# EAGLE design PLL_Board (EAGLE 5.10)
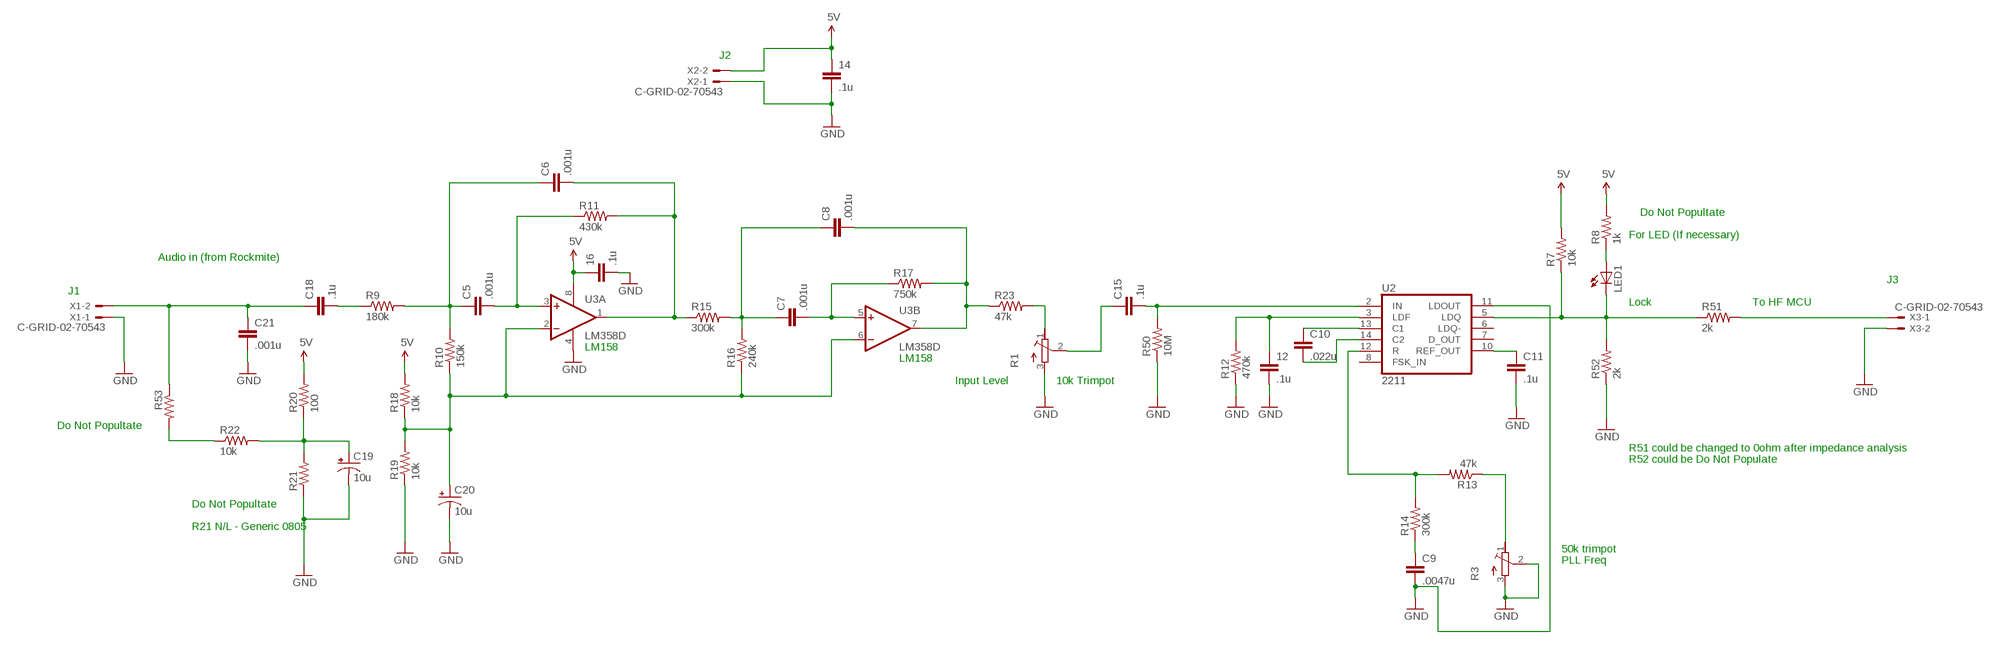
[diagram p0: schematic, sheet 1]

## Parts
12  .1u  CAP1210  [1210]
14  .1u  CAP1210  [1210]
16  .1u  CAP1210  [1210]
C5  .001u  CAP0805  [0805]
C6  .001u  CAP0805  [0805]
C7  .001u  CAP0805  [0805]
C8  .001u  CAP0805  [0805]
C9  .0047u  CAP0603-CAP  [0603-CAP]
C10  .022u  CAP0603-CAP  [0603-CAP]
C11  .1u  CAP1210  [1210]
C15  .1u  CAP1210  [1210]
C18  .1u  CAP1210  [1210]
C19  10u  CAP_POL7343  [EIA7343]
C20  10u  CAP_POL7343  [EIA7343]
C21  .001u  CAP0805  [0805]
LED1  LEDCHIPLED_0805  [CHIPLED_0805]
R1  R-TRIMMT93YA  [RTRIMT93YA]
R3  R-TRIMMT93YA  [RTRIMT93YA]
R7  10k  RESISTOR2010  [R2010]
R8  1k  RESISTOR1206  [1206]
R9  180k  RESISTOR  [0805]
R10  150k  RESISTOR1206  [1206]
R11  430k  RESISTOR1206  [1206]
R12  470k  RESISTOR1206  [1206]
R13  47k  RESISTOR2010  [R2010]
R14  300k  RESISTOR1206  [1206]
R15  300k  RESISTOR1206  [1206]
R16  240k  RESISTOR1206  [1206]
R17  750k  RESISTOR1206  [1206]
R18  10k  RESISTOR2010  [R2010]
R19  10k  RESISTOR2010  [R2010]
R20  100  RESISTOR1206  [1206]
R21  R-US_R0805  [R0805]
R22  10k  RESISTOR2010  [R2010]
R23  47k  RESISTOR2010  [R2010]
R50  10M  RESISTOR2010  [R2010]
R51  2k  R-US_R1210  [R1210]
R52  2k  R-US_R1210  [R1210]
R53  R-US_R0805  [R0805]
U2  2211  XR-2211  [DIL14]
U3  LM358D  [SO08]
X1  C-GRID-02-70543  [70543-02]
X2  C-GRID-02-70543  [70543-02]
X3  C-GRID-02-70543  [70543-02]

## Nets
5V: 14.1 16.1 R7.2 R8.2 R18.2 R20.2 U3.8(P:V+) X2.2
GND: 12.2 14.2 16.2 C9.2 C11.2 C19.C(-) C20.C(-) C21.2 R1.3(E) R3.2(S) R3.3(E) R12.1 R19.1 R21.1 R50.1 R52.1 U2.11(LDOUT) U3.4(P:V-) X1.1 X2.1 X3.2
N$2: C19.A(+) R20.1 R21.2 R22.2
N$3: C18.2 R9.1
N$4: C5.1 C6.1 R9.2 R10.2
N$5: C20.A(+) R10.1 R16.1 R18.1 R19.2 U3.2(A:-IN) U3.6(B:-IN)
N$6: C5.2 R11.1 U3.3(A:+IN)
N$7: C6.2 R11.2 R15.1 U3.1(A:OUT)
N$8: C18.1 C21.1 R53.1 X1.2
N$9: C7.1 C8.1 R15.2 R16.2
N$10: C7.2 R17.1 U3.5(B:+IN)
N$11: C8.2 R17.2 R23.1 U3.7(B:OUT)
N$12: R1.1(A) R23.2
N$13: C15.1 R1.2(S)
N$14: C15.2 R50.2 U2.2(IN)
N$15: 12.1 R12.2 U2.3(LDF)
N$16: C10.1 U2.13(C1)
N$17: C10.2 U2.14(C2)
N$18: R3.1(A) R13.1
N$19: C9.1 R14.1
N$20: R13.2 R14.2 U2.12(R)
N$21: C11.1 U2.10(REF_OUT)
N$22: LED1.C R7.1 R51.1 R52.2 U2.5(LDQ)
N$23: R51.2 X3.1
N$24: LED1.A R8.1
N$25: R22.1 R53.2
Unconnected: U2.6(LDQ-) U2.7(D_OUT) U2.8(FSK_IN)

## Notes on the sheet
- J2
- Do Not Popultate
- For LED (If necessary)
- Audio in (from Rockmite)
- J3
- J1
- Lock | To HF MCU
- LM158
- LM158
- Input Level | 10k Trimpot
- Do Not Popultate
- R51 could be changed to 0ohm after impedance analysis
- R52 could be Do Not Populate
- Do Not Popultate
- R21 N/L - Generic 0805
- 50k trimpot
- PLL Freq

## Power pins joined to a net without a drawn wire
GND: U2.4(GND)
VCC: U2.1(VCC)

## Library data of the parts
12 14 16 C5-C11 C15 C18 C21 = SparkFun:CAP: Capacitor Standard 0603 ceramic capacitor, and 0.1" leaded capacitor.
C19 C20 = SparkFun:CAP_POL: Capacitor Polarized These are standard SMD and PTH capacitors. Normally 10uF, 47uF, and 100uF in electrolytic and tantalum varieties. Always verify the external diameter of the through hole cap, it varies with capacity, voltage, and manufacturer. The EIA devices should be standard.
LED1 = led:LED: LED OSRAM: - CHIPLED LG R971, LG N971, LY N971, LG Q971, LY Q971, LO R971, LY R971 LH N974, LH R974 LS Q976, LO Q976, LY Q976 LO Q996 - Hyper CHIPLED LW Q18S LB Q993, LB Q99A, LB R99A - SideLED LS A670, LO A670, LY A670, LG A670, LP A670 LB A673, LV A673, LT A673, LW A673 LH A674 LY A675 LS A676, LA A676, LO A676, LY A676, LW A676 LS A679, LY A679, LG A679 - Hyper Micro SIDELED® LS Y876, LA Y876, LO Y876, LY Y876 LT Y87S - SmartLED LW L88C, LW L88S LB L89C, LB L89S, LG L890 LS L89K, LO L89K, LY L89K LS L896, LA L896, LO L896, LY L896 - TOPLED LS T670, LO T670, LY T670, LG T670, LP T670 LSG T670, LSP T670, LSY T670, LOP T670, LYG T670 LG T671, LOG T671, LSG T671 LB T673, LV T673, LT T673, LW T673 LH T674 LS T676, LA T676, LO T676, LY T676, LB T676, LH T676, LSB T676, LW T676 LB T67C, LV T67C, LT T67C, LS T67K, LO T67K, LY T67K, LW E67C LS E67B, LA E67B, LO E67B, LY E67B, LB E67C, LV E67C, LT E67C LW T67C LS T679, LY T679, LG T679 LS T770, LO T770, LY T770, LG T770, LP T770 LB T773, LV T773, LT T773, LW T773 LH T774 LS E675, LA E675, LY E675, LS T675 LS T776, LA T776, LO T776, LY T776, LB T776 LHGB T686 LT T68C, LB T68C - Hyper Mini TOPLED® LB M676 - Mini TOPLED Santana® LG M470 LS M47K, LO M47K, LY M47K Source: http://www.osram.convergy.de LUXEON: - LUMILED® LXK2-PW12-R00, LXK2-PW12-S00, LXK2-PW14-U00, LXK2-PW14-V00 LXK2-PM12-R00, LXK2-PM12-S00, LXK2-PM14-U00 LXK2-PE12-Q00, LXK2-PE12-R00, LXK2-PE12-S00, LXK2-PE14-T00, LXK2-PE14-U00 LXK2-PB12-K00, LXK2-PB12-L00, LXK2-PB12-M00, LXK2-PB14-N00, LXK2-PB14-P00, LXK2-PB14-Q00 LXK2-PR12-L00, LXK2-PR12-M00, LXK2-PR14-Q00, LXK2-PR14-R00 LXK2-PD12-Q00, LXK2-PD12-R00, LXK2-PD12-S00 LXK2-PH12-R00, LXK2-PH12-S00 LXK2-PL12-P00, LXK2-PL12-Q00, LXK2-PL12-R00 Source: www.luxeon.com KINGBRIGHT: KA-3528ASYC Source: www.kingbright.com
R1 R3 = resistor:R-TRIMM: Trimm resistor
R7-R20 R22 R23 R50 = SparkFun:RESISTOR: Resistor Basic schematic elements and footprints for 0603, 1206, and PTH 1/10th watt (small) resistors.
R21 R51-R53 = resistor:R-US_: RESISTOR, American symbol
U2 = exar:XR-2211: FSK demodulator TONE DECODER
U3 = linear:LM358: OP AMP also LM158; LM258; LM2904 Source: http://cache.national.com/ds/LM/LM158.pdf
X1-X3 = con-molex:C-GRID-02: CONNECTOR wire to board 2.54 mm (0.100") pitch header

## Board
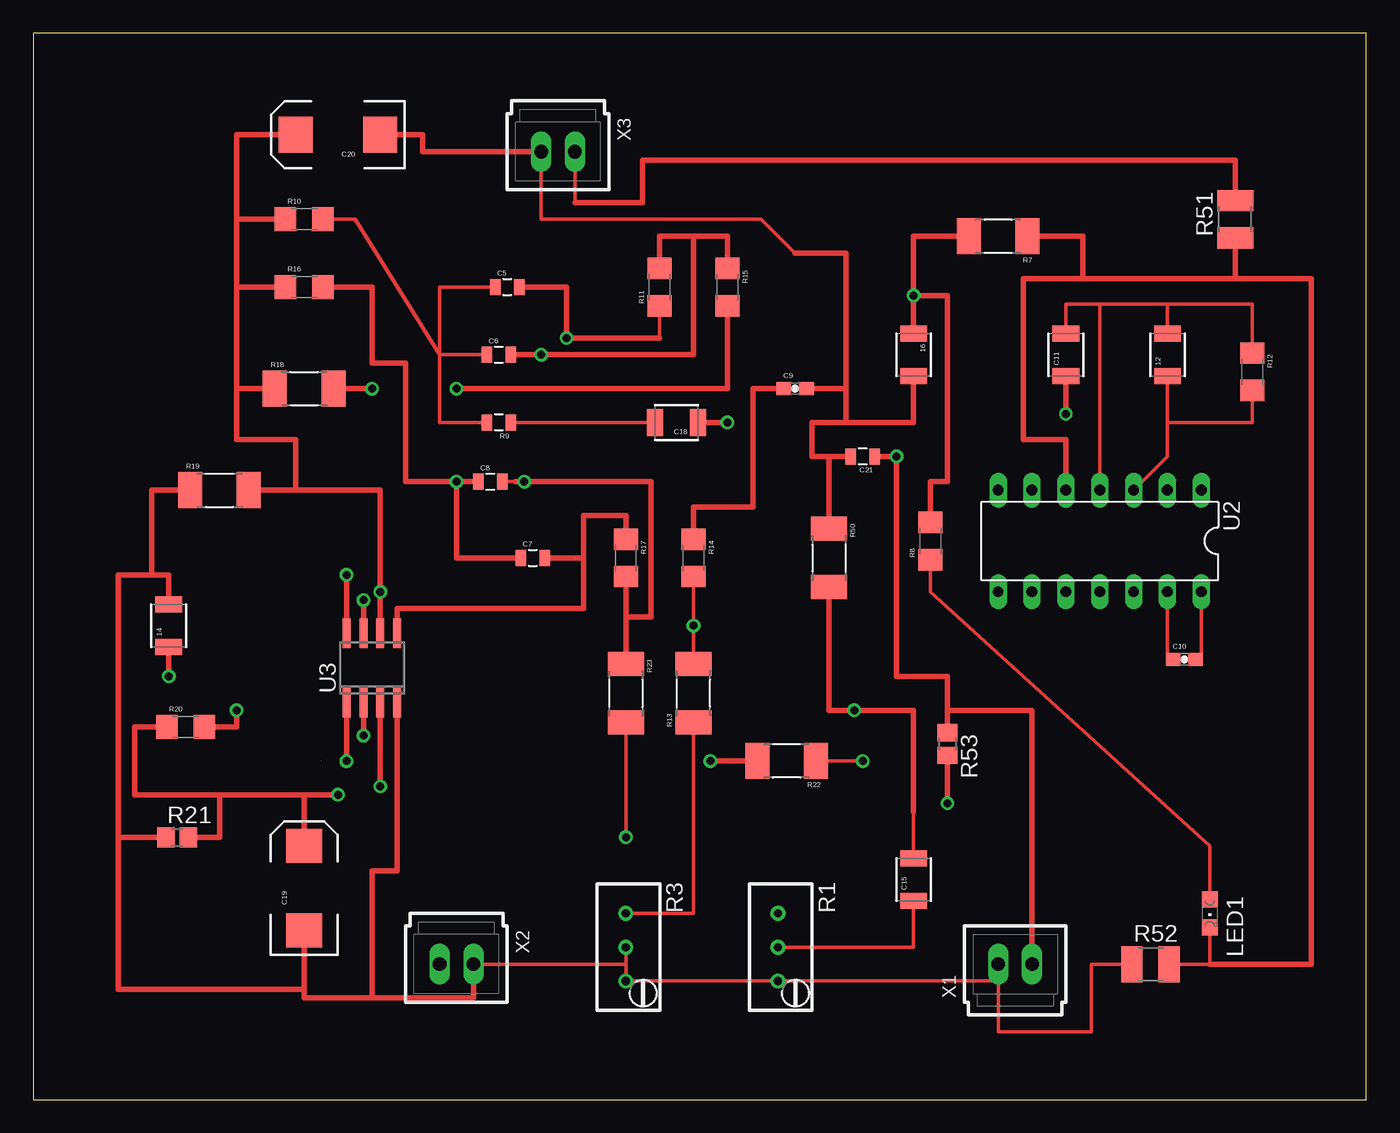
[diagram p1: board, top side]
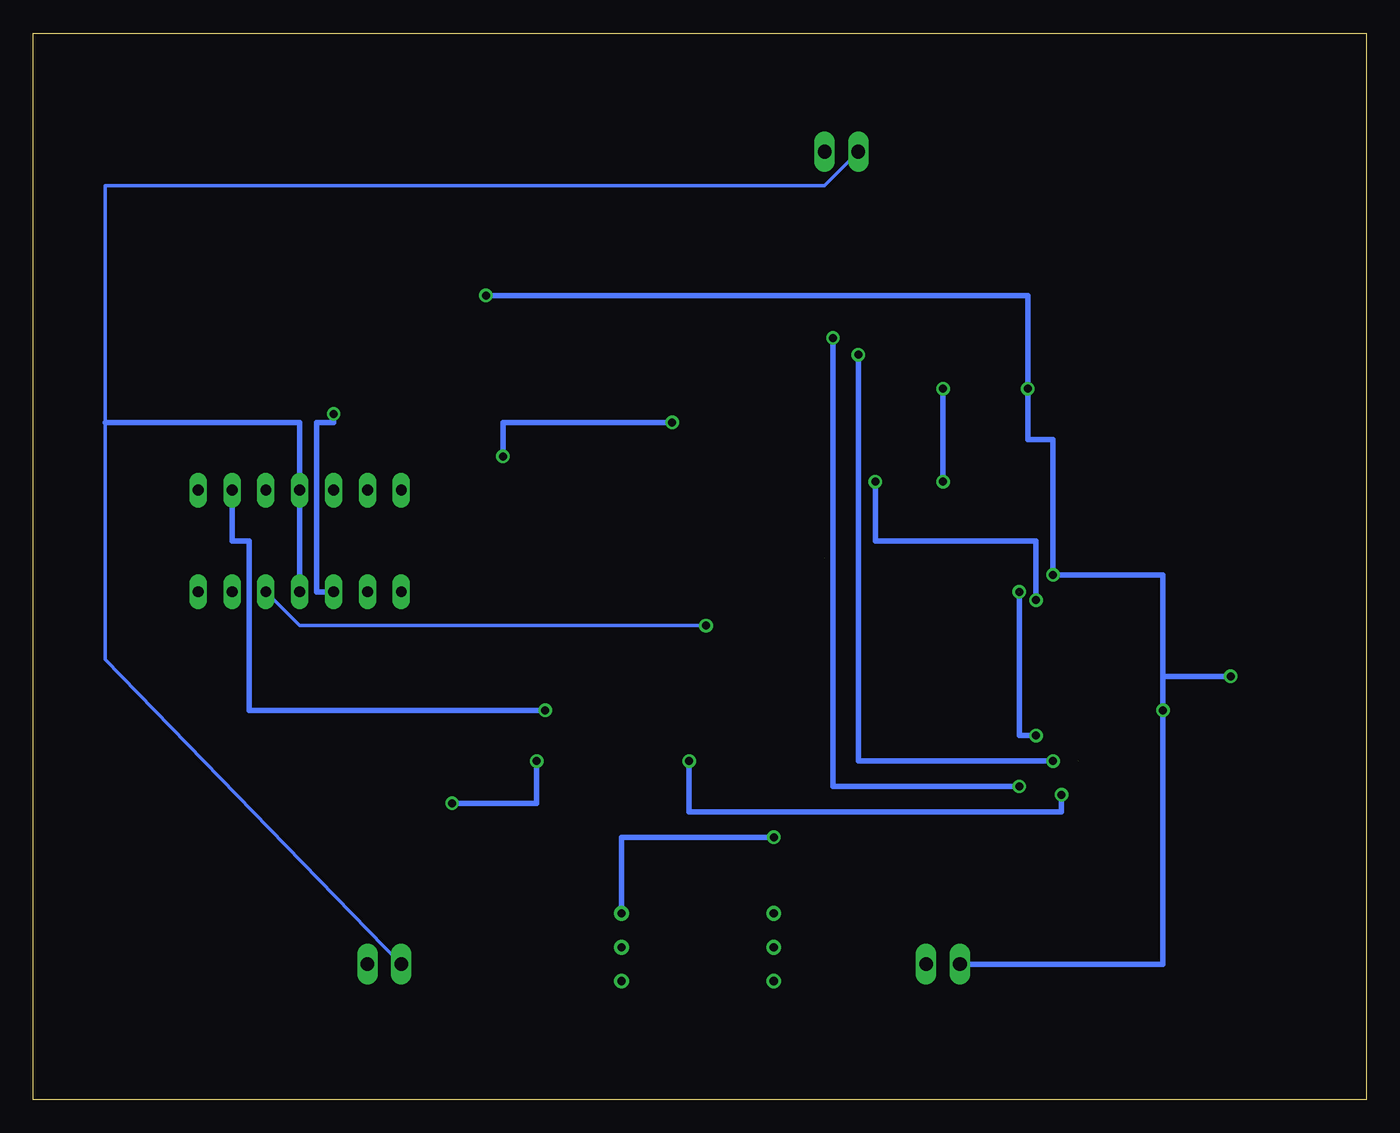
[diagram p2: board, bottom side, seen from below]

Size 100 x 80 mm. Coordinates in mm from the lower left corner, seen from the top.
Outline: 0,0 100,0 100,80 0,80 0,0
Copper layers (1*16): Top 0.035mm / dielectric 1.5mm / Bottom 0.035mm
Design rules "default": minimum track width 10mil, minimum drill 24mil, track to track 8mil, track to pad 8mil, pad to pad 8mil, via to via 8mil, smd to smd 8mil, copper to edge 40mil, drill to drill 8mil, minimum pad ring 10mil, minimum via ring 8mil, stop-mask expansion 4mil, vias tented up to drill 0mil, thermal gap 10mil

### Footprints (pad centres in the part's own frame; a part is rotated, then mirrored left to right if it is on the bottom)
1210 = smd 1.2 x 2: 1 -1.6,0; 2 1.6,0
0805 = smd 0.8 x 1.2: 1 -0.9,0; 2 0.9,0
0603-CAP = smd 1.1 x 1: 1 -0.85,0; 2 0.85,0
EIA7343 = smd 2.55 x 2.7: A 3.17,0; C -3.17,0
CHIPLED_0805 = smd 1.2 x 1.2: A 0,-1.05; C 0,1.05
RTRIMT93YA = drill 0.61 round: 1 0,-2.54; 2 0,0; 3 0,2.54
R2010 = smd 1.8 x 2.7: 1 -2.2,0; 2 2.2,0
1206 = smd 1.6 x 1.8: 1 -1.4,0; 2 1.4,0
R0805 = smd 1.3 x 1.5: 1 -0.85,0; 2 0.85,0
R1210 = smd 1.6 x 2.7: 1 -1.4,0; 2 1.4,0
DIL14 = drill 0.813 long: 1 -7.62,-3.81; 2 -5.08,-3.81; 3 -2.54,-3.81; 4 0,-3.81; 5 2.54,-3.81; 6 5.08,-3.81; 7 7.62,-3.81; 8 7.62,3.81; 9 5.08,3.81; 10 2.54,3.81; 11 0,3.81; 12 -2.54,3.81; 13 -5.08,3.81; 14 -7.62,3.81
SO08 = smd 0.6 x 2.2: 1 -1.905,-2.6; 2 -0.635,-2.6; 3 0.635,-2.6; 4 1.905,-2.6; 5 1.905,2.6; 6 0.635,2.6; 7 -0.635,2.6; 8 -1.905,2.6
70543-02 = drill 1.016 long: 1 -1.27,0; 2 1.27,0

### Placement (x,y rotation side)
12  85.09,55.88 90 top
14  10.16,35.56 90 top
16  66.04,55.88 270 top
C5  35.56,60.96 0 top
C6  34.92,55.88 0 top
C7  37.47,40.64 0 top
C8  34.29,46.35 0 top
C9  57.15,53.34 0 top
C10  86.36,33.02 0 top
C11  77.47,55.88 90 top
C15  66.04,16.51 90 top
C18  48.26,50.8 180 top
C19  20.32,15.88 90 top
C20  22.86,72.39 180 top
C21  62.23,48.26 180 top
LED1  88.27,13.97 180 top
R1  55.88,11.43 180 top
R3  44.45,11.43 180 top
R7  72.39,64.77 180 top
R8  67.31,41.91 90 top
R9  34.92,50.8 180 top
R10  20.32,66.04 0 top
R11  46.99,60.96 90 top
R12  91.44,54.61 270 top
R13  49.53,30.48 90 top
R14  49.53,40.64 270 top
R15  52.07,60.96 270 top
R16  20.32,60.96 0 top
R17  44.45,40.64 270 top
R18  20.32,53.34 0 top
R19  13.97,45.72 0 top
R20  11.43,27.94 0 top
R21  10.79,19.68 0 top
R22  56.52,25.4 180 top
R23  44.45,30.48 270 top
R50  59.69,40.64 270 top
R51  90.17,66.04 90 top
R52  83.82,10.16 0 top
R53  68.58,26.67 270 top
U2  80.01,41.91 180 top
U3  25.4,32.38 0 top
X1  73.66,10.16 0 top
X2  31.75,10.16 180 top
X3  39.37,71.12 180 top

### Tracks (layer width: path | path; a pad name or v marks a point on that pad's centre or on a via)
5V  (via drill 0.6)
  Top 0.406: 10.16,34.29 14.1 v10.16,31.75 | v23.5,39.37 U3.8 | 12.7,27.94 R20.2 15.24,27.94 v15.24,29.21 | v25.4,53.34 R18.2 | R7.2 66.04,64.77 16.1 v66.04,60.33 68.58,60.33 68.58,46.35 67.31,46.35 R8.2
  Bottom 0.406: 15.24,31.75 v10.16,31.75 | 15.24,31.75 v15.24,29.21 15.24,10.16 X2.2 | 15.24,31.75 15.24,39.37 v23.5,39.37 23.5,49.53 25.4,49.53 v25.4,53.34 25.4,60.33 v66.04,60.33
GND
  Top 0.254: 72.39,8.89 72.39,5.08 79.38,5.08 79.38,10.16 R52.1 82.55,10.16 | 44.45,10.16 R3.2 | 44.45,10.16 R3.3 R1.3 72.39,8.89 | X2.1 44.45,10.16 | 72.39,8.89 X1.1 | 85.09,59.69 91.44,59.69 R12.1 | 85.09,59.69 12.2 | 80.01,59.69 85.09,59.69 | 80.01,59.69 77.47,59.69 C11.2 | U2.4 80.01,59.69 | 66.04,54.61 16.2 | R50.1 59.69,43.18 | 57.15,63.5 54.61,66.04 38.1,66.04 X3.2 | C9.2 58.42,53.34
  Top 0.406: R19.1 8.89,45.72 8.89,39.37 | 8.89,39.37 10.16,39.37 14.2 | 8.89,39.37 6.35,39.37 6.35,19.68 | 6.35,19.68 R21.1 | 6.35,19.68 6.35,8.26 20.32,8.26 C19.C 20.32,7.62 25.4,7.62 | 25.4,7.62 33.02,7.62 X2.1 | 27.3,30.48 U3.4 27.3,17.14 25.4,17.14 25.4,7.62 | X3.2 29.21,71.12 29.21,72.39 C20.C | 66.04,54.61 66.04,50.8 60.96,50.8 | 60.96,53.34 60.96,50.8 | 60.96,50.8 58.42,50.8 58.42,48.26 59.69,48.26 | 59.69,48.26 C21.2 | 59.69,48.26 R50.1 | 60.96,53.34 C9.2 | 60.96,53.34 60.96,63.5 57.15,63.5
  Bottom 0.254: X3.2 40.64,68.58 94.61,68.58 94.61,50.8 94.61,33.02 X1.1
  Bottom 0.406: 94.61,50.8 80.01,50.8 U2.4 U2.11 80.01,37.47
N$1  (via drill 0.6)
  other vias: 26.04,38.1
N$2  (via drill 0.6)
  Top 0.406: R20.1 7.62,27.94 7.62,22.86 13.97,22.86 | 13.97,22.86 13.97,19.68 R21.2 | C19.A 19.68,19.05 C19.A 20.32,22.86 | 13.97,22.86 20.32,22.86 | 20.32,22.86 v22.86,22.86 | v50.8,25.4 R22.2
  Bottom 0.406: v22.86,22.86 22.86,21.59 50.8,21.59 v50.8,25.4
N$3
  Top 0.254: R9.1 C18.2 46.99,50.8
N$4
  Top 0.254: 30.48,55.88 30.48,50.8 R9.2 | 30.48,55.88 30.48,60.96 C5.1 | 30.48,55.88 24.13,66.04 R10.2 | 30.48,55.88 C6.1
N$5  (via drill 0.6)  (1 unrouted)
  Top 0.406: C20.A 15.24,72.39 15.24,66.04 | 15.24,53.34 15.24,60.96 | 15.24,60.96 15.24,66.04 | 15.24,53.34 R18.1 | 15.24,66.04 R10.1 | 19.05,60.96 R16.1 15.24,60.96 | 19.68,45.72 R19.2 | 19.68,45.72 19.68,49.53 15.24,49.53 15.24,53.34 | 19.68,45.72 26.04,45.72 U3.6 | v24.77,27.3 U3.2
  Bottom 0.406: v24.77,27.3 26.04,27.3 26.04,38.1
N$6  (via drill 0.6)
  Top 0.254: 46.99,57.15 R11.1
  Top 0.406: 46.99,57.15 v40.01,57.15 40.01,60.96 C5.2 | v26.04,23.5 U3.3
  Bottom 0.406: v26.04,23.5 40.01,23.5 v40.01,57.15
N$7  (via drill 0.6)
  Top 0.406: R15.1 52.07,64.77 49.53,64.77 | R11.2 46.99,64.77 49.53,64.77 | 49.53,64.77 49.53,55.88 v38.1,55.88 C6.2 | v23.5,25.4 U3.1
  Bottom 0.406: v23.5,25.4 38.1,25.4 v38.1,55.88
N$8  (via drill 0.6)
  Top 0.406: C21.1 v64.77,48.26 64.77,31.75 68.58,31.75 68.58,29.21 | R53.1 68.58,29.21 | v52.07,50.8 C18.1 | 68.58,29.21 74.93,29.21 X1.2
  Bottom 0.406: v52.07,50.8 64.77,50.8 v64.77,48.26
N$9  (via drill 0.6)
  Top 0.406: v31.75,46.35 C8.1 | R15.2 52.07,53.34 v31.75,53.34 | v31.75,46.35 31.75,40.64 C7.1 | R16.2 25.4,60.96 25.4,55.24 27.94,55.24 27.94,46.35 v31.75,46.35
  Bottom 0.406: v31.75,46.35 v31.75,53.34
N$10
  Top 0.406: U3.5 27.3,36.83 41.27,36.83 41.27,40.64 | 41.27,40.64 C7.2 | 41.27,40.64 41.27,43.81 44.45,43.81 R17.1
N$11  (via drill 0.6)
  Top 0.254: 36.2,46.35 C8.2 | R17.2 44.45,39.37
  Top 0.406: 36.2,46.35 v36.83,46.35 46.35,46.35 46.35,36.2 44.45,36.2 | 44.45,36.2 R17.2 | 44.45,36.2 R23.1 | U3.7 v24.77,37.47
  Bottom 0.406: v24.77,37.47 24.77,41.91 36.83,41.91 v36.83,46.35
N$12  (via drill 0.6)
  Top 0.254: v44.45,19.68 R23.2
  Bottom 0.406: v44.45,19.68 55.88,19.68 R1.1
N$13
  Top 0.254: R1.2 66.04,11.43 C15.1 66.04,15.24
N$14  (via drill 0.6)
  Top 0.254: C15.2 66.04,21.59
  Top 0.406: 66.04,21.59 66.04,29.21 v61.59,29.21 59.69,29.21 R50.2
  Bottom 0.406: v61.59,29.21 83.82,29.21 83.82,41.91 85.09,41.91 U2.2
N$15
  Top 0.254: 85.09,50.8 91.44,50.8 R12.2 | 85.09,50.8 12.1 85.09,54.61 | U2.3 85.09,48.26 85.09,50.8
N$16
  Top 0.254: U2.13 85.09,33.02 C10.1
N$17
  Top 0.254: U2.14 87.63,33.02 C10.2
N$18
  Top 0.254: R3.1 49.53,13.97 R13.1
N$19
  Top 0.406: R14.1 49.53,44.45 53.98,44.45 53.98,53.34 C9.1
N$20  (via drill 0.61)
  Top 0.254: 49.53,39.37 R14.2 v49.53,35.56 R13.2
  Bottom 0.254: U2.12 80.01,35.56 v49.53,35.56
N$21  (via drill 0.6)
  Top 0.254: C11.1 77.47,53.98
  Top 0.406: v77.47,51.44 C11.1
  Bottom 0.406: v77.47,51.44 77.47,50.8 78.74,50.8 78.74,38.1 U2.10
N$22
  Top 0.254: 85.09,10.16 R52.2 88.27,10.16 LED1.C
  Top 0.406: 88.27,10.16 95.89,10.16 95.89,61.59 90.17,61.59 | 90.17,61.59 R51.1 | R7.1 78.74,64.77 78.74,61.59 | 78.74,61.59 74.3,61.59 74.3,49.53 77.47,49.53 U2.5 | 90.17,61.59 78.74,61.59
N$23
  Top 0.254: 40.64,67.31 X3.1 | R51.2 90.17,67.31
  Top 0.406: 90.17,67.31 90.17,70.48 45.72,70.48 45.72,67.31 40.64,67.31
N$24
  Top 0.254: LED1.A 88.27,19.05 67.31,38.1 R8.1 67.31,40.64
N$25  (via drill 0.6)
  Top 0.254: R22.1 v62.23,25.4
  Top 0.406: v68.58,22.23 R53.2
  Bottom 0.406: v62.23,25.4 62.23,22.23 v68.58,22.23
N$26  (via drill 0.6)
  other vias: 15.24,29.21
N$27  (via drill 0.6)
  other vias: 50.8,25.4
N$28  (1 unrouted)
N$30  (via drill 0.6)
  other vias: 22.86,22.86
N$31  (via drill 0.6)
  other vias: 24.77,27.3
N$32  (1 unrouted)
N$33  (via drill 0.6)
  other vias: 24.77,37.47
N$34  (via drill 0.6)
  other vias: 25.4,53.34
N$35  (via drill 0.6)
  other vias: 52.07,50.8
N$36  (via drill 0.6)
  other vias: 68.58,22.23
N$37  (via drill 0.6)
  other vias: 77.47,51.44